# EAGLE board circuit (EAGLE 6.5.0), part 1 of 2
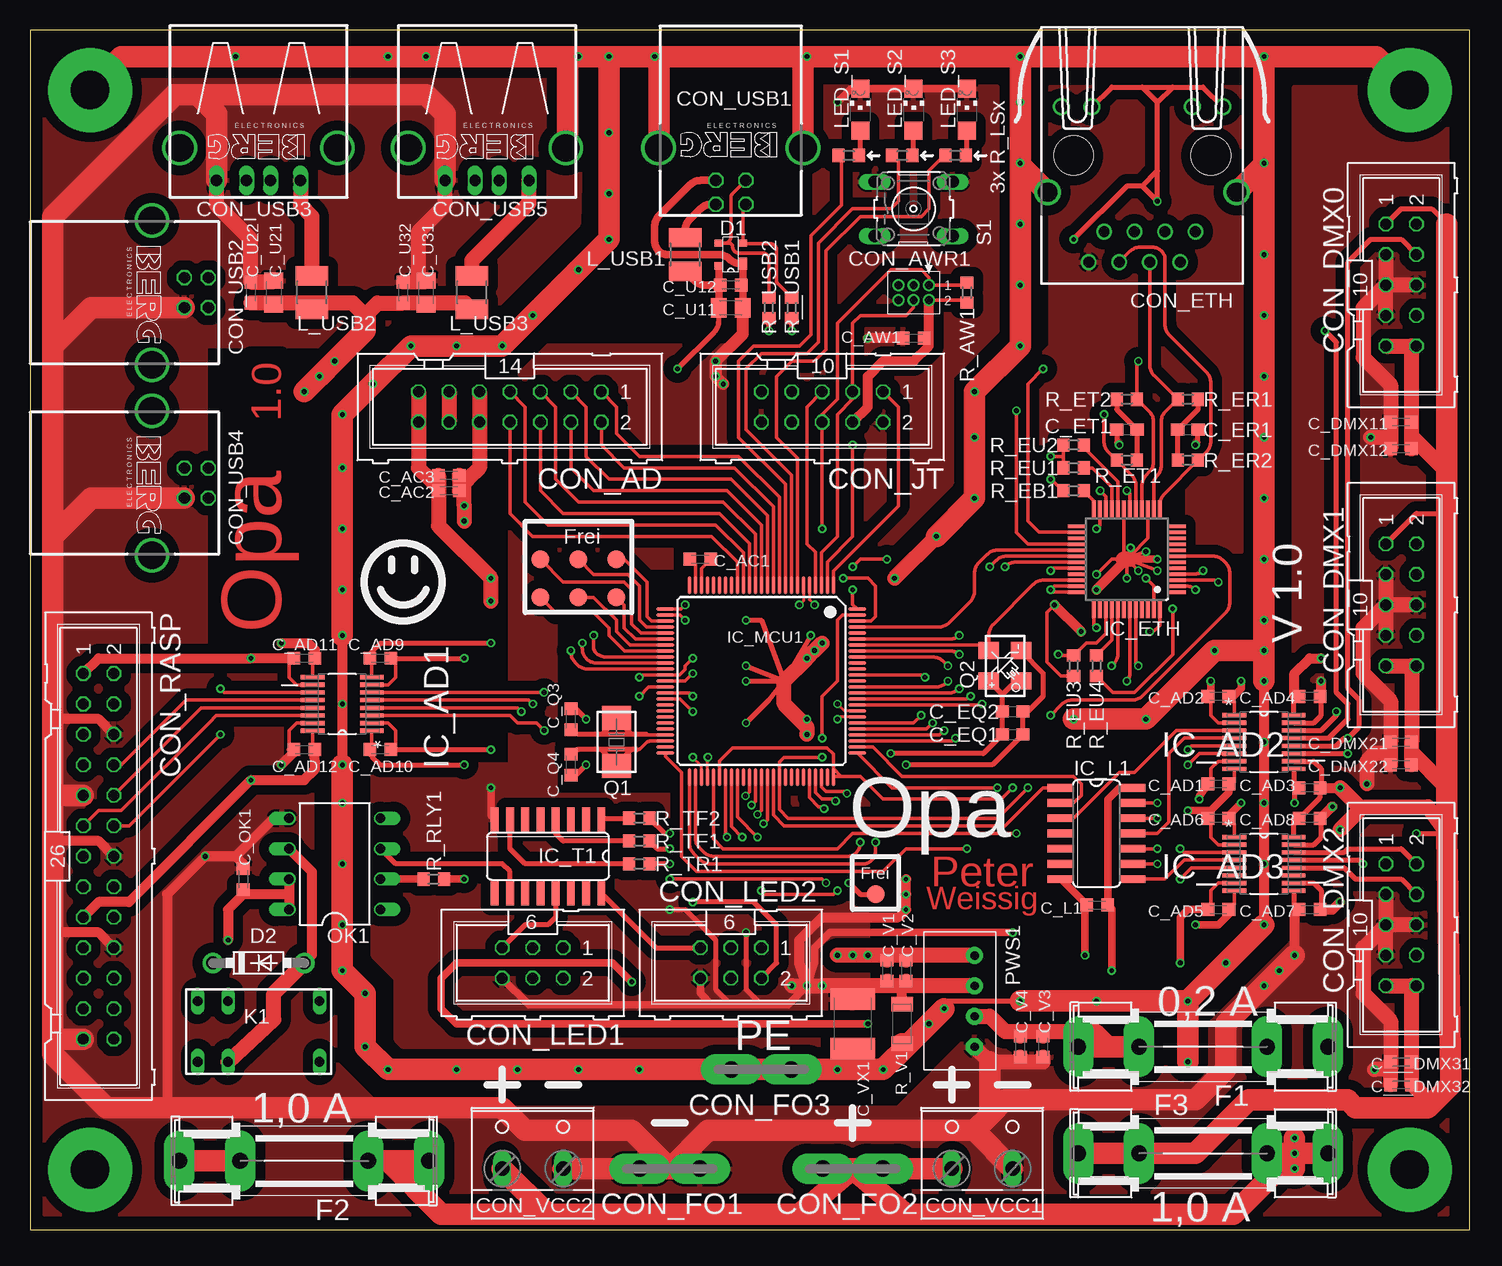
[diagram p5: board, top side]
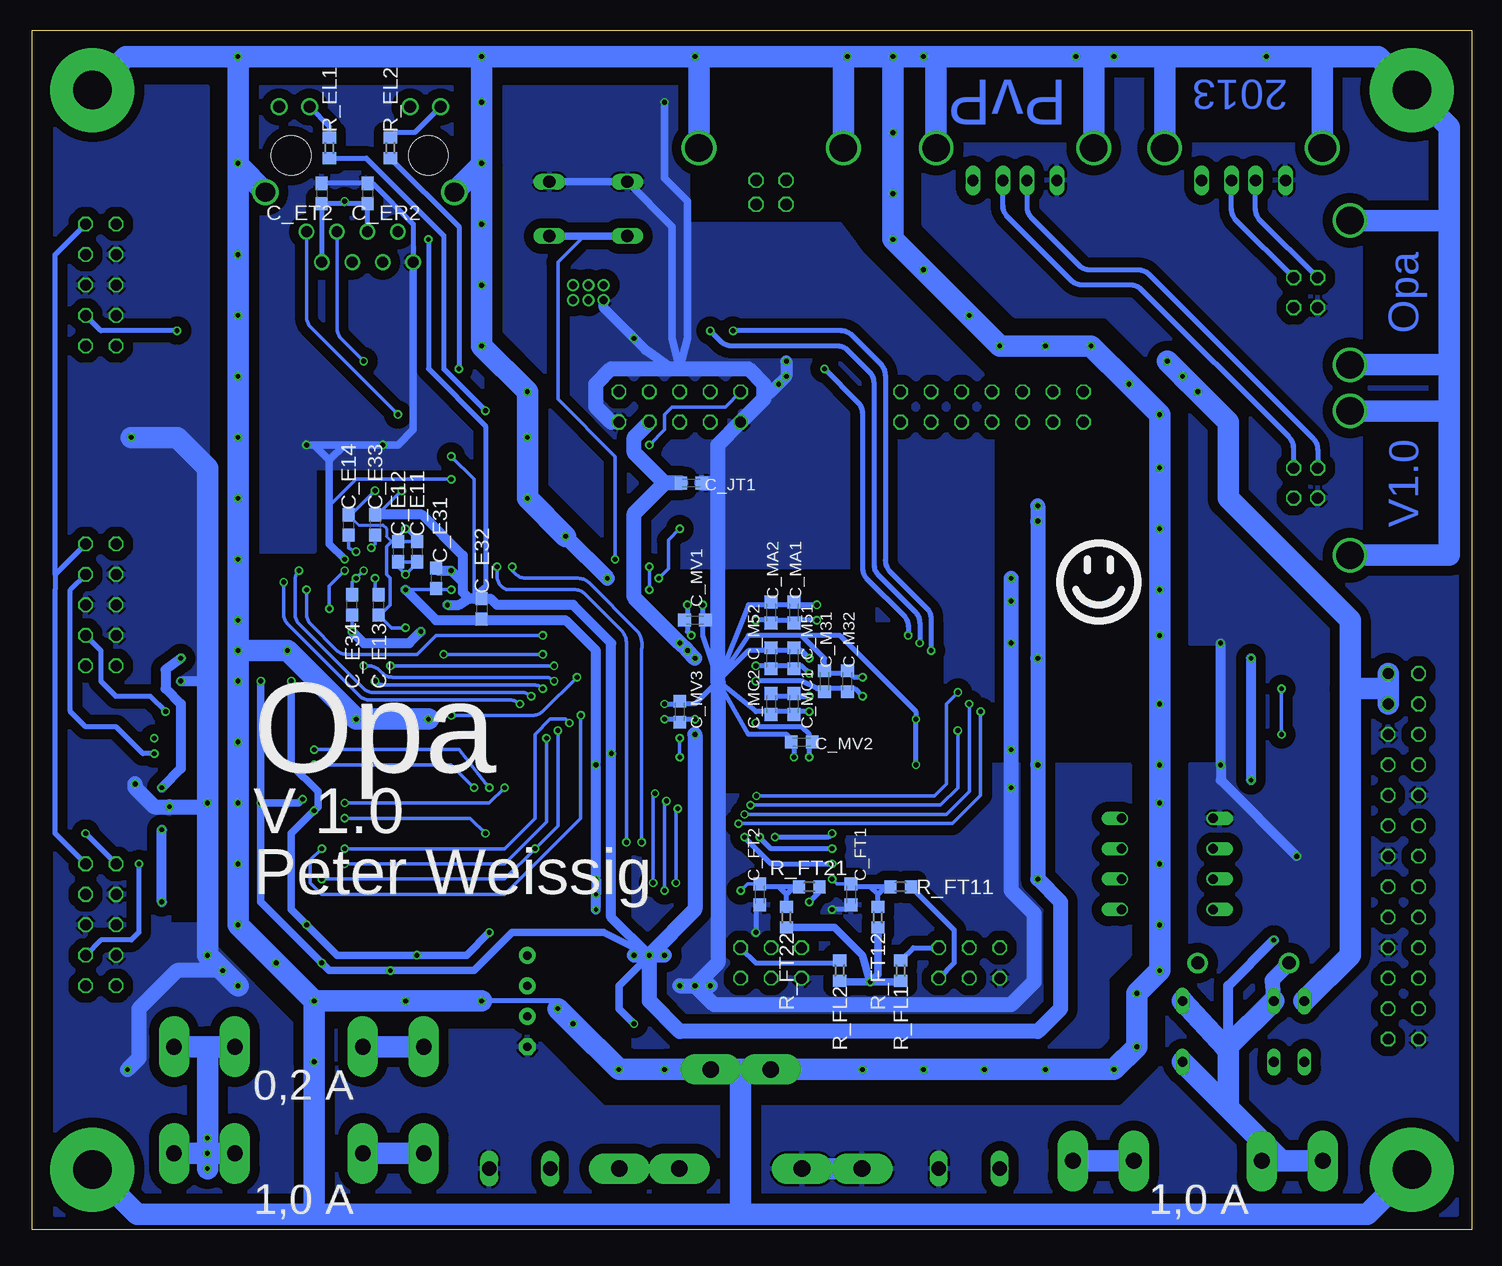
[diagram p6: board, bottom side, seen from below]

Size 120 x 100 mm. Coordinates in mm from the lower left corner, seen from the top.
Outline: 0,0 120,0 120,100 0,100 0,0
Copper layers (1*16): Top 0.035mm / dielectric 1.5mm / Bottom 0.035mm
Design rules "LeitOn - Standard-Eagle-DRU - 1- und  2-Lagen DK - deutsch - Rev 2.0": minimum track width 0.15mm, minimum drill 0.3mm, track to track 0.15mm, track to pad 0.15mm, pad to pad 0.15mm, via to via 0.15mm, smd to smd 0.15mm, copper to edge 0.3mm, drill to drill 0.3mm, minimum pad ring 0.15mm, minimum via ring 0.15mm, stop-mask expansion 0.075mm, vias tented up to drill 0mil, thermal gap 0.2mm
bRestrict: area 2.5,56.5 to 8.3,67.9; area 2.5,72.4 to 8.3,83.8; area 13.3,91.4 to 24.8,97.2; area 32.4,91.4 to 43.8,97.2
vRestrict: area 0,0 to 120,3; area 0,97 to 120,100; area 0,0 to 3,100; area 117,0 to 120,100

## Footprints (pad centres in the part's own frame; a part is rotated, then mirrored left to right if it is on the bottom)
C0603K = smd 1.05 x 1.08: 1 -0.875,0; 2 0.875,0
C0603 = smd 1.1 x 1: 1 -0.85,0; 2 0.85,0
C0805K = smd 1.3 x 1.6: 1 -1,0; 2 1,0
C1812K = smd 1.8 x 3.7: 1 -2.05,0; 2 2.05,0
ML14 = drill 0.914 octagon: 1 -7.62,-1.27; 2 -7.62,1.27; 3 -5.08,-1.27; 4 -5.08,1.27; 5 -2.54,-1.27; 6 -2.54,1.27; 7 0,-1.27; 8 0,1.27; 9 2.54,-1.27; 10 2.54,1.27; 11 5.08,-1.27; 12 5.08,1.27; 13 7.62,-1.27; 14 7.62,1.27
2X3_MINI = drill 0.65 pad 1: 1 -1.27,-0.635; 2 -1.27,0.635; 3 0,-0.635; 4 0,0.635; 5 1.27,-0.635; 6 1.27,0.635
ML10 = drill 0.914 octagon: 1 -5.08,-1.27; 2 -5.08,1.27; 3 -2.54,-1.27; 4 -2.54,1.27; 5 0,-1.27; 6 0,1.27; 7 2.54,-1.27; 8 2.54,1.27; 9 5.08,-1.27; 10 5.08,1.27
MAG_JACK = drill 0.9 pad 1.3: 1 -4.445,2.54; 2 -3.175,5.08; 3 -1.905,2.54; 4 -0.635,5.08; 5 0.635,2.54; 6 1.905,5.08; 7 3.175,2.54; 8 4.445,5.08 | drill 1 pad 1.422: GRN_A 4.195,-7.87; GRN_C 6.735,-7.87; YE_A -6.735,-7.87; YE_C -4.195,-7.87 | drill 1.6 pad 2.184: M1 -7.875,-0.76; M2 7.875,-0.76 | hole 3.3: 5.715,-3.81; -5.715,-3.81
F061.100 = drill 1.4 pad 2.54 long: A1 -2.5,0; A2 2.5,0
ML6 = drill 0.914 octagon: 1 -2.54,-1.27; 2 -2.54,1.27; 3 0,-1.27; 4 0,1.27; 5 2.54,-1.27; 6 2.54,1.27
ML26 = drill 0.914 octagon: 1 -15.24,-1.27; 2 -15.24,1.27; 3 -12.7,-1.27; 4 -12.7,1.27; 5 -10.16,-1.27; 6 -10.16,1.27; 7 -7.62,-1.27; 8 -7.62,1.27; 9 -5.08,-1.27; 10 -5.08,1.27; 11 -2.54,-1.27; 12 -2.54,1.27; 13 0,-1.27; 14 0,1.27; 15 2.54,-1.27; 16 2.54,1.27; 17 5.08,-1.27; 18 5.08,1.27; 19 7.62,-1.27; 20 7.62,1.27; 21 10.16,-1.27; 22 10.16,1.27; 23 12.7,-1.27; 24 12.7,1.27; 25 15.24,-1.27; 26 15.24,1.27
PN61729-S = drill 0.95 octagon: 1 1.25,4.71; 2 -1.25,4.71; 3 -1.25,2.71; 4 1.25,2.71 | drill 2.3 pad 2.9: S1 -6.02,0; S2 6.02,0
PN87520-S = drill 0.95 long: 1 -3.5,2.71; 2 -1,2.71; 3 1,2.71; 4 3.5,2.71 | drill 2.3 pad 2.9: S1 -6.57,0; S2 6.57,0
W237-132 = drill 1.194 long: 1 -2.54,-0.635; 2 2.54,-0.635
SOT143-R = smd 1 x 0.7: 1 -0.75,-1 | smd 0.6 x 0.7: 2 0.95,-1; 3 0.95,1; 4 -0.95,1
DO41-7.6 = drill 1.1 pad 1.7: A 3.81,0; C -3.81,0
SHK20L = drill 1.321 pad 2.54 long: 1A -10.414,0; 1B -5.334,0; 2A 10.414,0; 2B 5.334,0
SOP64P600X175-16N = smd 1.981 x 0.356: 1 -2.464,2.235; 2 -2.464,1.6; 3 -2.464,0.965; 4 -2.464,0.33; 5 -2.464,-0.33; 6 -2.464,-0.965; 7 -2.464,-1.6; 8 -2.464,-2.235; 9 2.464,-2.235; 10 2.464,-1.6; 11 2.464,-0.965; 12 2.464,-0.33; 13 2.464,0.33; 14 2.464,0.965; 15 2.464,1.6; 16 2.464,2.235
LQFP48 = smd 1.5 x 0.3: 1 -4.15,2.75; 2 -4.15,2.25; 3 -4.15,1.75; 4 -4.15,1.25; 5 -4.15,0.75; 6 -4.15,0.25; 7 -4.15,-0.25; 8 -4.15,-0.75; 9 -4.15,-1.25; 10 -4.15,-1.75; 11 -4.15,-2.25; 12 -4.15,-2.75; 25 4.15,-2.75; 26 4.15,-2.25; 27 4.15,-1.75; 28 4.15,-1.25; 29 4.15,-0.75; 30 4.15,-0.25; 31 4.15,0.25; 32 4.15,0.75; 33 4.15,1.25; 34 4.15,1.75; 35 4.15,2.25; 36 4.15,2.75 | smd 0.3 x 1.5: 13 -2.75,-4.15; 14 -2.25,-4.15; 15 -1.75,-4.15; 16 -1.25,-4.15; 17 -0.75,-4.15; 18 -0.25,-4.15; 19 0.25,-4.15; 20 0.75,-4.15; 21 1.25,-4.15; 22 1.75,-4.15; 23 2.25,-4.15; 24 2.75,-4.15; 37 2.75,4.15; 38 2.25,4.15; 39 1.75,4.15; 40 1.25,4.15; 41 0.75,4.15; 42 0.25,4.15; 43 -0.25,4.15; 44 -0.75,4.15; 45 -1.25,4.15; 46 -1.75,4.15; 47 -2.25,4.15; 48 -2.75,4.15
SO14 = smd 0.66 x 2.032: 1 -3.81,-3.073; 2 -2.54,-3.073; 3 -1.27,-3.073; 4 0,-3.073; 5 1.27,-3.073; 6 2.54,-3.073; 7 3.81,-3.073; 8 3.81,3.073; 9 2.54,3.073; 10 1.27,3.073; 11 0,3.073; 12 -1.27,3.073; 13 -2.54,3.073; 14 -3.81,3.073
TQFP100 = smd 1.5 x 0.3: 1 -8,6; 2 -8,5.5; 3 -8,5; 4 -8,4.5; 5 -8,4; 6 -8,3.5; 7 -8,3; 8 -8,2.5; 9 -8,2; 10 -8,1.5; 11 -8,1; 12 -8,0.5; 13 -8,0; 14 -8,-0.5; 15 -8,-1; 16 -8,-1.5; 17 -8,-2; 18 -8,-2.5; 19 -8,-3; 20 -8,-3.5; 21 -8,-4; 22 -8,-4.5; 23 -8,-5; 24 -8,-5.5; 25 -8,-6; 51 8,-6; 52 8,-5.5; 53 8,-5; 54 8,-4.5; 55 8,-4; 56 8,-3.5; 57 8,-3; 58 8,-2.5; 59 8,-2; 60 8,-1.5; 61 8,-1; 62 8,-0.5; 63 8,0; 64 8,0.5; 65 8,1; 66 8,1.5; 67 8,2; 68 8,2.5; 69 8,3; 70 8,3.5; 71 8,4; 72 8,4.5; 73 8,5; 74 8,5.5; 75 8,6 | smd 0.3 x 1.5: 26 -6,-8; 27 -5.5,-8; 28 -5,-8; 29 -4.5,-8; 30 -4,-8; 31 -3.5,-8; 32 -3,-8; 33 -2.5,-8; 34 -2,-8; 35 -1.5,-8; 36 -1,-8; 37 -0.5,-8; 38 0,-8; 39 0.5,-8; 40 1,-8; 41 1.5,-8; 42 2,-8; 43 2.5,-8; 44 3,-8; 45 3.5,-8; 46 4,-8; 47 4.5,-8; 48 5,-8; 49 5.5,-8; 50 6,-8; 76 6,8; 77 5.5,8; 78 5,8; 79 4.5,8; 80 4,8; 81 3.5,8; 82 3,8; 83 2.5,8; 84 2,8; 85 1.5,8; 86 1,8; 87 0.5,8; 88 0,8; 89 -0.5,8; 90 -1,8; 91 -1.5,8; 92 -2,8; 93 -2.5,8; 94 -3,8; 95 -3.5,8; 96 -4,8; 97 -4.5,8; 98 -5,8; 99 -5.5,8; 100 -6,8
SO16 = smd 0.66 x 2.032: 1 -4.445,-3.073; 2 -3.175,-3.073; 3 -1.905,-3.073; 4 -0.635,-3.073; 5 0.635,-3.073; 6 1.905,-3.073; 7 3.175,-3.073; 8 4.445,-3.073; 9 4.445,3.073; 10 3.175,3.073; 11 1.905,3.073; 12 0.635,3.073; 13 -0.635,3.073; 14 -1.905,3.073; 15 -3.175,3.073; 16 -4.445,3.073
G5V1 = drill 0.813 long: 1 -5.08,-2.54; 2 -2.54,-2.54; 5 5.08,-2.54; 6 5.08,2.54; 9 -2.54,2.54; 10 -5.08,2.54
L1210 = smd 1.6 x 2.7: 1 -1.4,0; 2 1.4,0
CHIPLED_1206 = smd 1.5 x 1.5: A 0,-1.75; C 0,1.75
DIL08 = drill 0.813 offset: 1 -3.81,-3.81; 2 -1.27,-3.81; 3 1.27,-3.81; 4 3.81,-3.81; 5 3.81,3.81; 6 1.27,3.81; 7 -1.27,3.81; 8 -3.81,3.81
TRACO_TME_1 = drill 0.7 pad 1.4 octagon: 1 -3.82,0 | drill 0.7 pad 1.4: 2 -1.28,0; 3 1.26,0; 4 3.8,0
NX5032 = smd 2 x 2.4: 1 -2,0; 2 2,0
XO53 = smd 1.4 x 1.7: 1 -1.27,-1.35; 2 1.27,-1.35; 3 1.27,1.35; 4 -1.27,1.35
R0603 = smd 1 x 1.1: 1 -0.85,0; 2 0.85,0
CT/CN1206 = smd 1.2 x 1.8: 1 -1.65,0; 2 1.65,0
B3F-10XX = drill 1.016 long: 1 -3.251,2.261; 2 3.251,2.261; 3 -3.251,-2.261; 4 3.251,-2.261
TP15R = smd 1.5 x 1.5: TP 0,0

## Placement (x,y rotation side)
C_AC1  100 nF  [C0603K]  55.88,55.88 180 top
C_AC2  100 nF  [C0603K]  34.92,61.59 180 top
C_AC3  100 nF  [C0603K]  34.92,62.87 180 top
C_AD1  100 nF  [C0603K]  99.06,37.15 0 top
C_AD2  100 nF  [C0603K]  99.06,44.45 0 top
C_AD3  100 nF  [C0603K]  106.68,36.83 0 top
C_AD4  100 nF  [C0603K]  106.68,44.45 0 top
C_AD5  100 nF  [C0603K]  99.06,26.67 0 top
C_AD6  100 nF  [C0603K]  99.06,34.29 0 top
C_AD7  100 nF  [C0603K]  106.68,26.67 180 top
C_AD8  100 nF  [C0603K]  106.68,34.29 180 top
C_AD9  100 nF  [C0603K]  29.21,47.62 180 top
C_AD10  100 nF  [C0603K]  29.21,40.01 180 top
C_AD11  100 nF  [C0603K]  22.86,47.62 0 top
C_AD12  100 nF  [C0603K]  22.86,40.01 0 top
C_AW1  100 nF  [C0603K]  73.66,74.3 180 top
C_DMX11  2,2 µF  [C0603K]  114.3,67.31 0 top
C_DMX12  100 nF  [C0603K]  114.3,65.09 0 top
C_DMX21  2,2 µF  [C0603K]  114.3,40.64 0 top
C_DMX22  100 nF  [C0603K]  114.3,38.73 0 top
C_DMX31  2,2 µF  [C0603K]  114.3,13.97 0 top
C_DMX32  100 nF  [C0603K]  114.3,12.06 0 top
C_E11  10 µF  [C0603]  87.95,56.52 270 bottom
C_E12  100 nF  [C0603]  89.53,56.52 270 bottom
C_E13  100 nF  [C0603]  91.12,52.07 90 bottom
C_E14  100 nF  [C0603]  93.66,58.74 270 bottom
C_E31  10 µF  [C0603]  86.36,54.29 270 bottom
C_E32  100 nF  [C0603]  82.55,51.75 270 bottom
C_E33  100 nF  [C0603]  91.44,58.74 270 bottom
C_E34  100 nF  [C0603]  93.34,52.07 90 bottom
C_EQ1  10 µF  [C0603]  81.92,41.27 0 top
C_EQ2  100 nF  [C0603]  81.92,43.18 0 top
C_ER1  100 nF  [C0603]  96.52,66.67 0 top
C_ER2  1 µF  [C0603]  92.08,86.36 270 bottom
C_ET1  100 nF  [C0603]  91.44,66.67 180 top
C_ET2  1 µF  [C0603]  95.89,86.36 270 bottom
C_FT1  100 nF  [C0603K]  51.75,27.94 270 bottom
C_FT2  100 nF  [C0603K]  59.37,27.94 270 bottom
C_JT1  100 nF  [C0603K]  65.09,62.23 0 bottom
C_L1  100 nF  [C0603K]  88.97,27.05 180 top
C_M31  2,2 µF  [C0603K]  53.98,45.72 90 bottom
C_M32  470 pF  [C0603K]  52.07,45.72 90 bottom
C_M51  2,2 µF  [C0603K]  56.52,47.62 90 bottom
C_M52  470 pF  [C0603K]  58.42,47.62 90 bottom
C_MA1  2,2 µF  [C0603K]  56.52,51.44 90 bottom
C_MA2  470 pF  [C0603K]  58.42,51.44 90 bottom
C_MC1  2,2 µF  [C0603K]  56.52,43.81 270 bottom
C_MC2  470 pF  [C0603K]  58.42,43.81 270 bottom
C_MV1  100 nF  [C0603K]  64.77,50.8 0 bottom
C_MV2  100 nF  [C0603K]  55.88,40.64 180 bottom
C_MV3  100 nF  [C0603K]  66.04,43.18 90 bottom
C_OK1  100 nF  [C0603K]  17.78,29.21 270 top
C_Q3  15 pF  [C0603K]  45.09,42.55 90 top
C_Q4  15 pF  [C0603K]  45.09,38.73 270 top
C_U11  10 µF  [C0805K]  58.42,76.83 0 top
C_U12  100 nF  [C0603K]  58.42,78.74 0 top
C_U21  10 µF  [C0805K]  20.32,78.11 90 top
C_U22  100 nF  [C0603K]  18.41,78.11 90 top
C_U31  10 µF  [C0805K]  33.02,78.11 90 top
C_U32  100 nF  [C0603K]  31.11,78.11 90 top
C_V1  10 µF  [C0603K]  71.44,21.59 270 top
C_V2  100 nF  [C0603K]  73.03,21.59 270 top
C_V3  10 µF  [C0603K]  84.45,15.24 270 top
C_V4  100 nF  [C0603K]  82.55,15.24 270 top
C_VX1  100nF; 1kV  [C1812K]  68.58,17.14 270 top
CON_AD  [ML14]  40.01,68.58 180 top
CON_AWR1  2x3 1,27mm  [2X3_MINI]  73.66,78.11 180 top
CON_DMX0  [ML10]  114.3,78.74 270 top
CON_DMX1  [ML10]  114.3,52.07 270 top
CON_DMX2  [ML10]  114.3,25.4 270 top
CON_ETH  SI-60062-F  [MAG_JACK]  92.71,85.72 180 top
CON_FO1  PIN2F061.100  [F061.100]  53.34,5.08 0 top
CON_FO2  PIN2F061.100  [F061.100]  68.58,5.08 0 top
CON_FO3  PIN2F061.100  [F061.100]  60.96,13.34 0 top
CON_JT  [ML10]  66.04,68.58 180 top
CON_LED1  [ML6]  41.91,22.23 180 top
CON_LED2  [ML6]  58.42,22.23 180 top
CON_RASP  [ML26]  5.71,31.11 270 top
CON_USB1  PN61729-S  [PN61729-S]  58.42,90.17 180 top
CON_USB2  PN61729-S  [PN61729-S]  10.16,78.11 270 top
CON_USB3  PN87520-S  [PN87520-S]  19.05,90.17 180 top
CON_USB4  PN61729-S  [PN61729-S]  10.16,62.23 270 top
CON_USB5  PN87520-S  [PN87520-S]  38.1,90.17 180 top
CON_VCC1  [W237-132]  79.38,5.71 0 top
CON_VCC2  [W237-132]  41.91,5.71 0 top
D1  PRTR5V0U2X  [SOT143-R]  58.42,81.28 90 top
D2  1N5817-B  [DO41-7.6]  19.05,22.23 0 top
F1  200 mA  [SHK20L]  97.79,15.24 180 top
F2  1 A  [SHK20L]  22.86,5.71 180 top
F3  1 A  [SHK20L]  97.79,6.35 0 top
IC_AD1  ADUM7442  [SOP64P600X175-16N]  26.04,43.81 180 top
IC_AD2  ADUM7442  [SOP64P600X175-16N]  102.87,40.64 0 top
IC_AD3  ADUM7442  [SOP64P600X175-16N]  102.87,30.48 0 top
IC_ETH  DP83848  [LQFP48]  91.44,55.88 180 top
IC_L1  74AC08D  [SO14]  88.9,33.02 270 top
IC_MCU1  AT32UC3C1512/1256/1128  [TQFP100]  60.96,45.72 270 top
IC_T1  ULN2003AD  [SO16]  43.18,31.11 180 top
K1  TR5V-M5  [G5V1]  19.05,16.51 0 top
L_USB1  10µH/500mA  [L1210]  54.61,81.28 270 top
L_USB2  10µH/500mA  [L1210]  23.5,78.11 90 top
L_USB3  10µH/500mA  [L1210]  36.83,78.11 90 top
LED_S1  Rot  [CHIPLED_1206]  69.22,93.34 0 top
LED_S2  Gelb  [CHIPLED_1206]  73.66,93.34 0 top
LED_S3  Grün  [CHIPLED_1206]  78.11,93.34 0 top
OK1  HCPL2601  [DIL08]  25.4,30.48 90 top
PWS1  TRACO - SIM1-0503  [TRACO_TME_1]  78.74,19.05 90 top
Q1  16Mhz; 8pF  [NX5032]  48.9,40.64 90 top
Q2  50 MHz  [XO53]  81.28,46.99 90 top
R_AW1  47k  [R0603]  78.11,78.11 270 top
R_EB1  4k87; 1%  [R0603]  87,61.59 180 top
R_EL1  200 R  [R0603]  95.25,90.17 90 bottom
R_EL2  200 R  [R0603]  90.17,90.17 90 bottom
R_ER1  51 R  [R0603]  96.52,69.22 180 top
R_ER2  51 R  [R0603]  96.52,64.14 0 top
R_ET1  51 R  [R0603]  91.44,64.14 180 top
R_ET2  51 R  [R0603]  91.44,69.22 0 top
R_EU1  2k2  [R0603]  87,63.5 180 top
R_EU2  2k2  [R0603]  87,65.41 180 top
R_EU3  2k2  [R0603]  87,46.99 90 top
R_EU4  2k2  [R0603]  88.9,46.99 90 top
R_FL1  200 R  [R0603]  47.62,21.59 270 bottom
R_FL2  200 R  [R0603]  52.7,21.59 270 bottom
R_FT11  1k  [R0603]  47.62,28.57 180 bottom
R_FT12  10k  [R0603]  49.53,26.04 270 bottom
R_FT21  1k  [R0603]  55.24,28.57 180 bottom
R_FT22  10k  [R0603]  57.15,26.04 270 bottom
R_LS1  1k  [R0603]  68.26,89.53 180 top
R_LS2  1k  [R0603]  72.71,89.53 180 top
R_LS3  1k  [R0603]  77.15,89.53 180 top
R_RLY1  150 R  [R0603]  33.66,29.21 180 top
R_TF1  10k  [R0603]  50.8,32.38 0 top
R_TF2  10k  [R0603]  50.8,34.29 0 top
R_TR1  10k  [R0603]  50.8,30.48 0 top
R_USB1  39R; 0,1W  [R0603]  63.5,76.83 90 top
R_USB2  39R; 0,1W  [R0603]  61.59,76.83 90 top
R_V1  70V  [CT/CN1206]  72.71,17.14 90 top
S1  B3FS-1010  [B3F-10XX]  73.66,85.09 0 top
TP_MCU1  TPTP15R  [TP15R]  48.9,55.88 0 top
TP_MCU2  TPTP15R  [TP15R]  45.72,55.88 0 top
TP_MCU3  TPTP15R  [TP15R]  42.55,55.88 0 top
TP_MCU4  TPTP15R  [TP15R]  48.9,52.7 0 top
TP_MCU5  TPTP15R  [TP15R]  45.72,52.7 0 top
TP_MCU6  TPTP15R  [TP15R]  42.55,52.7 0 top
TP_MCU7  TPTP15R  [TP15R]  70.48,27.94 0 top